# Altium schematic sheet H-mostik2.SchDoc
size A
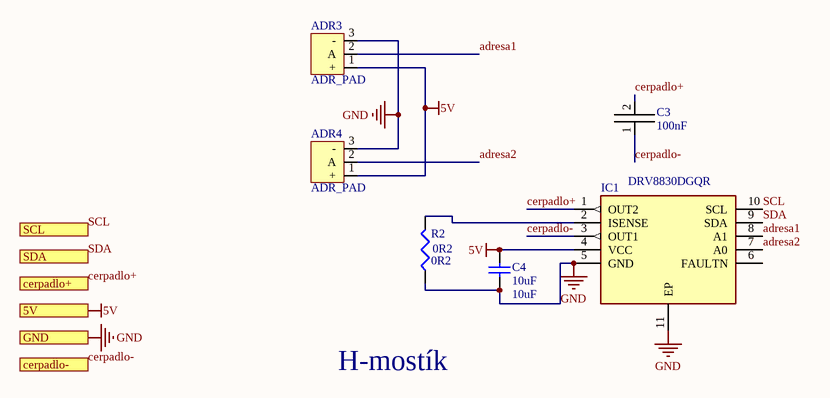
[diagram p0: H-mostik2.SchDoc]

## Parts
ADR3  ADR_PAD  [SOLDER_PAD]
ADR4  ADR_PAD  [SOLDER_PAD]
C3  100nF  [Capacitor]
C4  10uF  [C2512]
IC1  DRV8830DGQR  [SOP50P490X110-11N]
R2  0R2  [J1-0603]

## Ports
5V, cerpadlo+, cerpadlo-, GND, SCL, SDA

## Nets
5V: ADR3.1(+) ADR4.1(+) C4.2 IC1.4(VCC) ; port 5V
GND: ADR3.3(-) ADR4.3(-) C4.1 IC1.5(GND) IC1.11(EP) R2.1 ; port GND
adresa1: ADR3.2(A) IC1.8(A1)
adresa2: ADR4.2(A) IC1.7(A0)
cerpadlo+: C3.2 IC1.1(OUT2) ; port cerpadlo+
cerpadlo-: C3.1 IC1.3(OUT1) ; port cerpadlo-
SCL: IC1.10(SCL) ; port SCL
SDA: IC1.9(SDA) ; port SDA
NetIC1_2: IC1.2(ISENSE) R2.2

Not connected (* = marked no-connect by the designer): IC1 6(FAULTN)

## Notes on the sheet
- H-mostík

## Library data of the parts
ADR3 ADR4 = ADR_PAD: ADR PAD 3 PIN
C3 = Cap
C4 = Cap Semi: Capacitor (Semiconductor SIM Model); Published: 8-Jun-2000; LatestRevisionDate: 29-May-2009; LatestRevisionNote: IPC-7351 Footprint Added.; PackageReference: C1206; Publisher: Altium Limited; PackageDescription: Chip Capacitor; Value: 10uF
IC1 = DRV8830DGQR: Integrated Circuit; Manufacturer_Name: Texas Instruments; Datasheet Link: http://www.ti.com/lit/ds/symlink/drv8830.pdf; Height: 1.1mm; Manufacturer_Part_Number: DRV8830DGQR; Mouser Part Number: 595-DRV8830DGQR; Mouser Price/Stock: https://www.mouser.com/Search/Refine.aspx?Keyword=595-DRV8830DGQR; RS Part Number: 1626149; RS Price/Stock: http://uk.rs-online.com/web/p/products/1626149
R2 = Res3: Resistor; Published: 8-Jun-2000; LatestRevisionDate: 29-May-2009; LatestRevisionNote: IPC-7351 Footprint Added.; PackageReference: J1-0603; Publisher: Altium Limited; PackageDescription: Chip Resistor; Value: 0R2